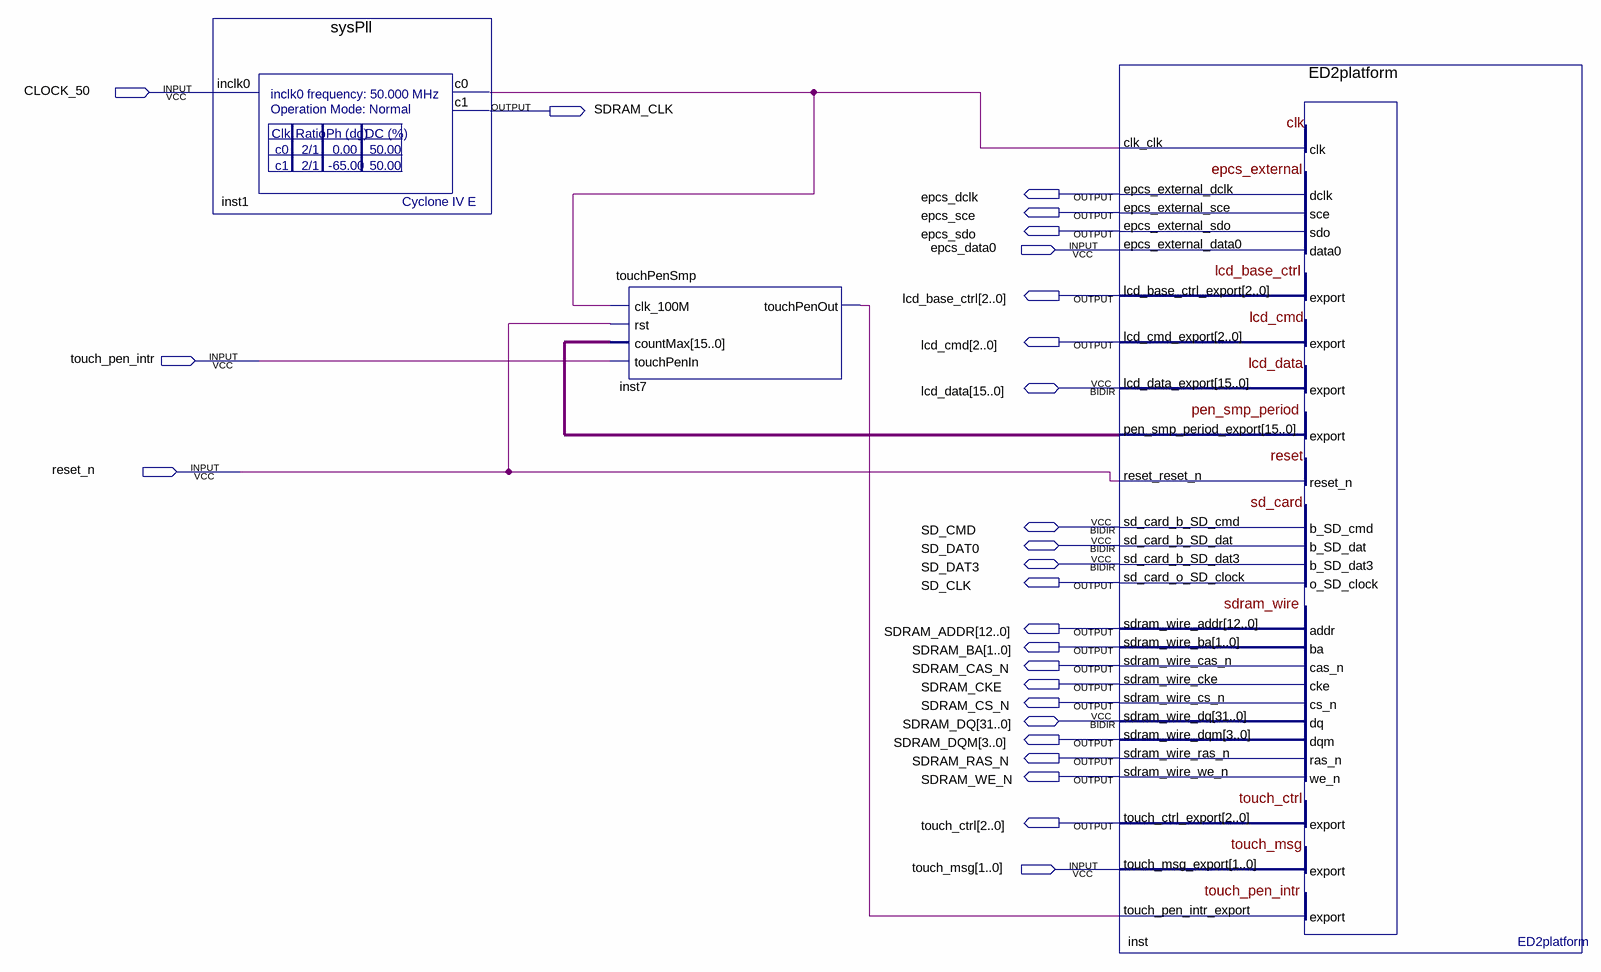
[diagram p0: schematic sheet]
// Quartus schematic DE2_115.bdf as structural Verilog: 3 symbols, 26 pins
module DE2_115 (
  input  CLOCK_50,
  input  epcs_data0,
  input  touch_pen_intr,
  input  reset_n,
  input  [1:0] touch_msg,
  inout  [15:0] lcd_data,
  inout  SD_CMD,
  inout  SD_DAT0,
  inout  SD_DAT3,
  inout  [31:0] SDRAM_DQ,
  output SDRAM_CLK,
  output epcs_dclk,
  output epcs_sce,
  output epcs_sdo,
  output [2:0] lcd_base_ctrl,
  output [2:0] lcd_cmd,
  output SD_CLK,
  output [12:0] SDRAM_ADDR,
  output [1:0] SDRAM_BA,
  output SDRAM_CAS_N,
  output SDRAM_CKE,
  output SDRAM_CS_N,
  output [3:0] SDRAM_DQM,
  output SDRAM_RAS_N,
  output SDRAM_WE_N,
  output [2:0] touch_ctrl
);

  wire inst1_c0, inst7_touchpenout;
  wire [15:0] inst_pen_smp_period_export;

  sysPll inst1 (.inclk0(CLOCK_50), .c0(inst1_c0), .c1(SDRAM_CLK));
  touchPenSmp inst7 (
    .clk_100M(inst1_c0), .rst(reset_n), .countMax(inst_pen_smp_period_export), .touchPenIn(touch_pen_intr),
    .touchPenOut(inst7_touchpenout));
  ED2platform inst (
    .clk_clk(inst1_c0), .epcs_external_data0(epcs_data0), .reset_reset_n(reset_n),
    .touch_msg_export(touch_msg), .touch_pen_intr_export(inst7_touchpenout), .epcs_external_dclk(epcs_dclk),
    .epcs_external_sce(epcs_sce), .epcs_external_sdo(epcs_sdo), .lcd_base_ctrl_export(lcd_base_ctrl),
    .lcd_cmd_export(lcd_cmd), .pen_smp_period_export(inst_pen_smp_period_export),
    .sd_card_o_SD_clock(SD_CLK), .sdram_wire_addr(SDRAM_ADDR), .sdram_wire_ba(SDRAM_BA),
    .sdram_wire_cas_n(SDRAM_CAS_N), .sdram_wire_cke(SDRAM_CKE), .sdram_wire_cs_n(SDRAM_CS_N),
    .sdram_wire_dqm(SDRAM_DQM), .sdram_wire_ras_n(SDRAM_RAS_N), .sdram_wire_we_n(SDRAM_WE_N),
    .touch_ctrl_export(touch_ctrl), .lcd_data_export(lcd_data), .sd_card_b_SD_cmd(SD_CMD),
    .sd_card_b_SD_dat(SD_DAT0), .sd_card_b_SD_dat3(SD_DAT3), .sdram_wire_dq(SDRAM_DQ));
endmodule
